# Altium schematic sheet MCU.SchDoc
size A2; DocumentNumber: 2; SheetNumber: 1; SheetTotal: 5
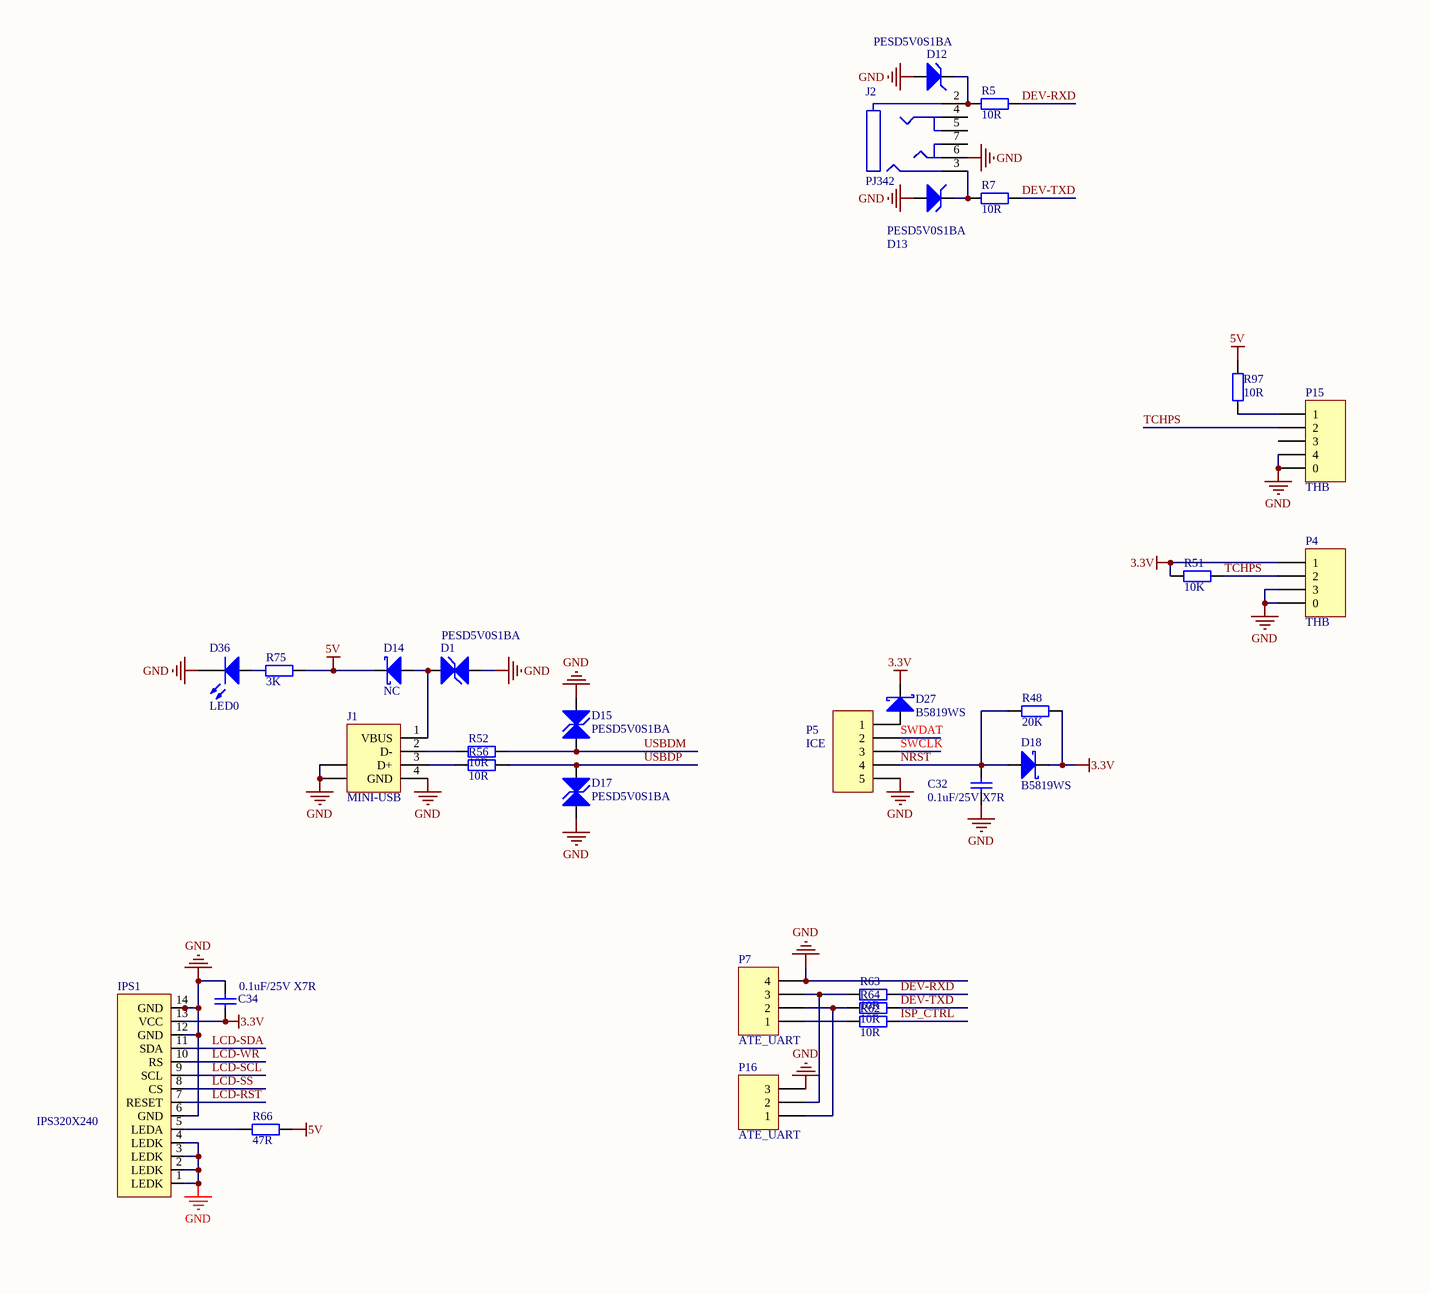
[diagram p0: MCU.SchDoc, left]
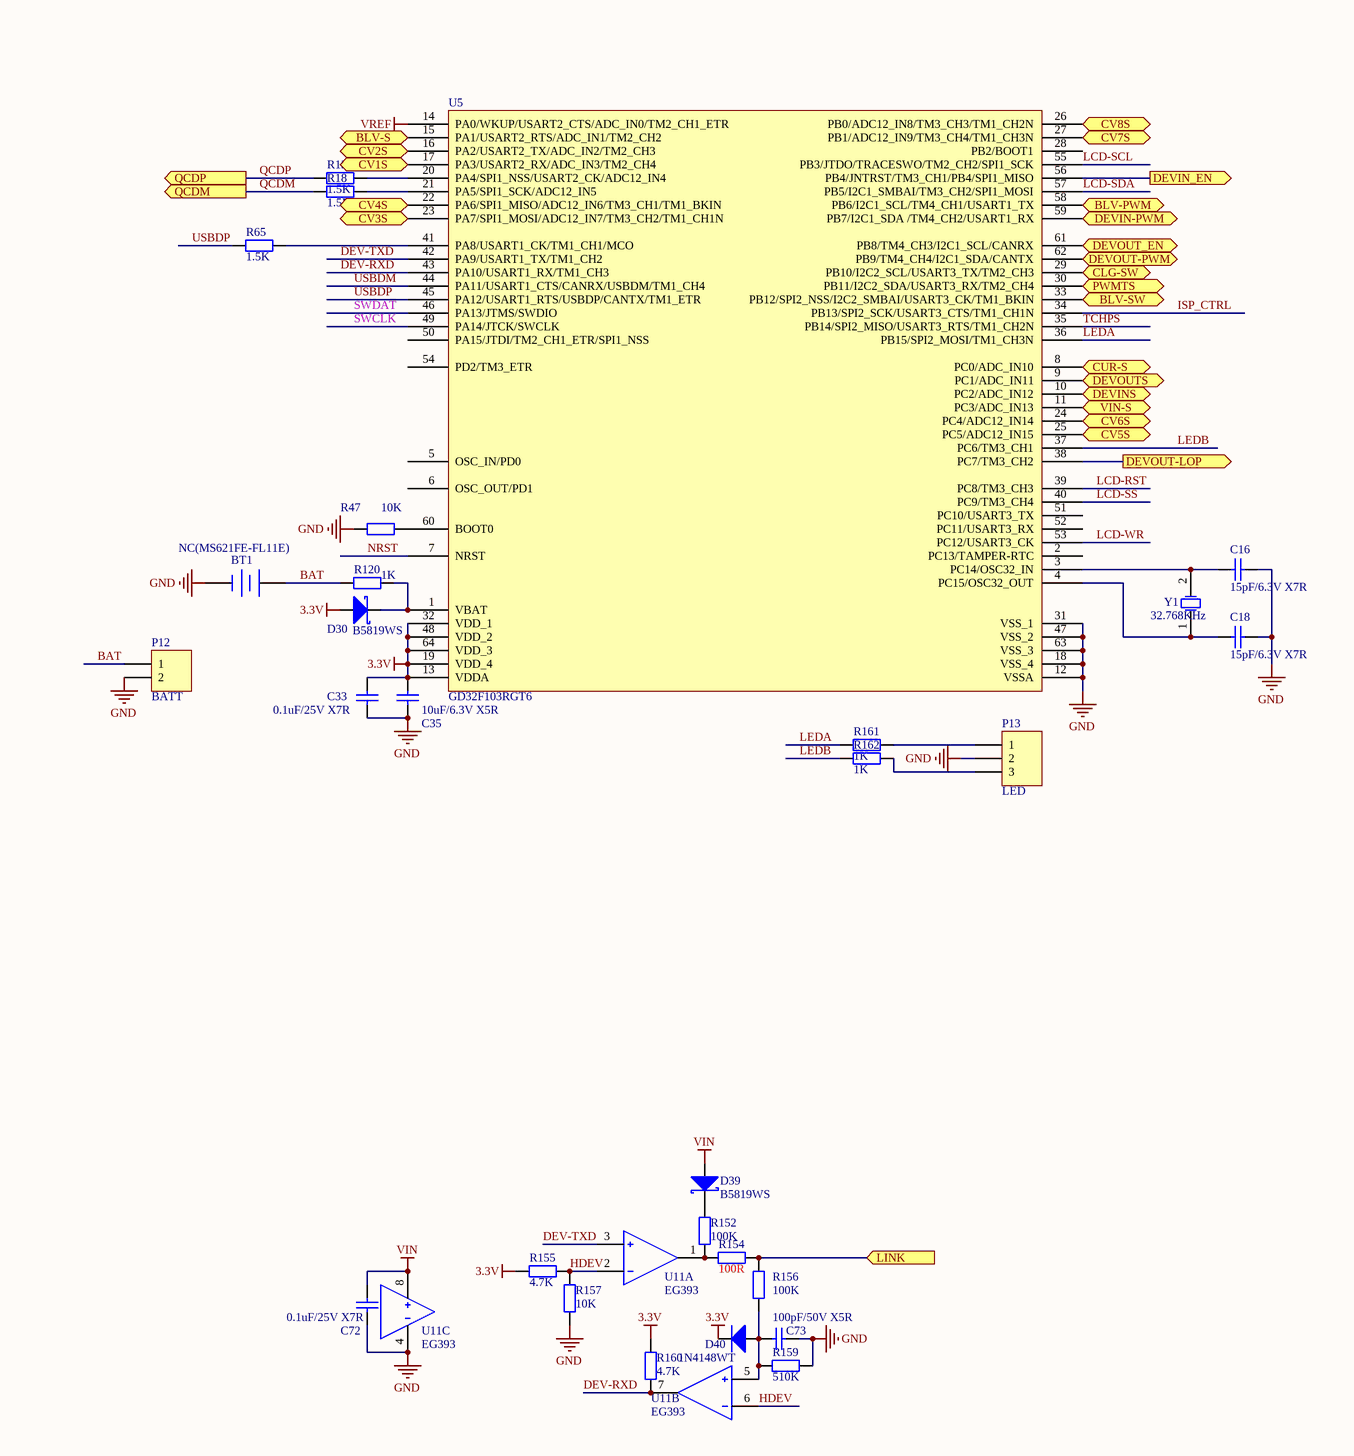
[diagram p1: MCU.SchDoc, right]

## Parts
BT1  NC(MS621FE-FL11E)  [MS621FE FL11E]
C16  15pF/6.3V X7R  [C-0603]
C18  15pF/6.3V X7R  [C-0603]
C32  0.1uF/25V X7R  [C-0603]
C33  0.1uF/25V X7R  [C-0603]
C34  0.1uF/25V X7R  [C-0603]
C35  10uF/6.3V X5R  [C-0603]
C72  0.1uF/25V X7R  [C-0603]
C73  100pF/50V X5R  [C-0603]
D1  PESD5V0S1BA  [SOD-323]
D12  PESD5V0S1BA  [SOD-323]
D13  PESD5V0S1BA  [SOD-323]
D14  NC  [SOD-323]
D15  PESD5V0S1BA  [SOD-323]
D17  PESD5V0S1BA  [SOD-323]
D18  B5819WS  [SOD-323]
D27  B5819WS  [SOD-323]
D30  B5819WS  [SOD-323]
D36  LED0  [LED-SMD-0603]
D39  B5819WS  [SOD-323]
D40  1N4148WT  [SOD-323]
IPS1  IPS320X240  [0.5K-AS-NPWB-14P]
J1  MINI-USB  [USB-MINI-C]
J2  PJ342  [PJ342]
P4  THB  [1.25T-3P-SMT]
P5  ICE  [1.25T-5P]
P7  ATE_UART  [XH 2.54-4P]
P12  BATT  [PH-2A]
P13  LED  [HDR1X3]
P15  THB  [1.25T-4P-SMT]
P16  ATE_UART  [XH 2.54-3P]
R5  10R  [R-0603]
R7  10R  [R-0603]
R13  1.5K  [R-0603]
R18  1.5K  [R-0603]
R47  10K  [R-0603]
R48  20K  [R-0603]
R51  10K  [R-0603]
R52  10R  [R-0603]
R56  10R  [R-0603]
R62  10R  [R-0603]
R63  10R  [R-0603]
R64  10R  [R-0603]
R65  1.5K  [R-0603]
R66  47R  [R-0805]
R75  3K  [R-0603]
R97  10R  [R-0603]
R120  1K  [R-0603]
R152  100K  [R-0603]
R154  100R  [R-0603]
R155  4.7K  [R-0603]
R156  100K  [R-0603]
R157  10K  [R-0603]
R159  510K  [R-0603]
R160  4.7K  [R-0603]
R161  1K  [R-0603]
R162  1K  [R-0603]
U5  GD32F103RGT6  [TSQFP50P1200X1200X160-64N]
U11  EG393  [SOIC8]  (parts A,B,C of 3)
Y1  32.768KHz  [DT-38]

## Ports
BLV-PWM (out), BLV-S (in), BLV-SW (out), CLG-SW (out), CUR-S (in), CV1S (in), CV2S (in), CV3S (in), CV4S (in), CV5S (in), CV6S (in), CV7S (in), CV8S (in), DEVIN-PWM (out), DEVIN_EN (out), DEVINS (in), DEVOUT-LOP (out), DEVOUT-PWM (out), DEVOUT_EN (out), DEVOUTS (in), LINK (in), PWMTS (out), QCDM (out), QCDP (out), VIN-S (in)

## Nets
3.3V: C33.2 C34.2 C35.2 D18.2(K) D27.2(K) D30.1(A) D40.2(K) IPS1.13(VCC) P4.1 R48.1 R51.2 R155.2 R160.2 U5.13(VDDA) U5.19(VDD_4) U5.32(VDD_1) U5.48(VDD_2) U5.64(VDD_3)
5V: D14.2(K) R66.2 R75.1 R97.2
GND: BT1.2(-) C16.1 C18.1 C32.2 C33.1 C34.1 C35.1 C72.2 C73.1 D1.1 D12.1(A) D13.1(A) D15.1 D17.1 D36.2(K) IPS1.0 IPS1.1(LEDK) IPS1.2(LEDK) IPS1.3(LEDK) IPS1.4(LEDK) IPS1.6(GND) IPS1.12(GND) IPS1.14(GND) J1.4(GND) J1.5(SHLD) J1.6(SHLD) J2.6 P4.0 P4.3 P5.5 P7.4 P12.2 P13.2 P15.0 P15.4 P16.3 R47.2 R157.1 R159.1 U5.12(VSSA) U5.18(VSS_4) U5.31(VSS_1) U5.47(VSS_2) U5.63(VSS_3) U11.4
VIN: C72.1 D39.1(A) U11.8
VREF: U5.14(PA0/WKUP/USART2_CTS/ADC_IN0/TM2_CH1_ETR)
BAT: BT1.1(+) P12.1 R120.2
BLV-PWM: U5.58(PB6/I2C1_SCL/TM4_CH1/USART1_TX) ; port BLV-PWM
BLV-S: U5.15(PA1/USART2_RTS/ADC_IN1/TM2_CH2) ; port BLV-S
BLV-SW: U5.33(PB12/SPI2_NSS/I2C2_SMBAI/USART3_CK/TM1_BKIN) ; port BLV-SW
CLG-SW: U5.29(PB10/I2C2_SCL/USART3_TX/TM2_CH3) ; port CLG-SW
CUR-S: U5.8(PC0/ADC_IN10) ; port CUR-S
CV1S: U5.17(PA3/USART2_RX/ADC_IN3/TM2_CH4) ; port CV1S
CV2S: U5.16(PA2/USART2_TX/ADC_IN2/TM2_CH3) ; port CV2S
CV3S: U5.23(PA7/SPI1_MOSI/ADC12_IN7/TM3_CH2/TM1_CH1N) ; port CV3S
CV4S: U5.22(PA6/SPI1_MISO/ADC12_IN6/TM3_CH1/TM1_BKIN) ; port CV4S
CV5S: U5.25(PC5/ADC12_IN15) ; port CV5S
CV6S: U5.24(PC4/ADC12_IN14) ; port CV6S
CV7S: U5.27(PB1/ADC12_IN9/TM3_CH4/TM1_CH3N) ; port CV7S
CV8S: U5.26(PB0/ADC12_IN8/TM3_CH3/TM1_CH2N) ; port CV8S
DEV-RXD: R5.1 R63.1 R160.1 U5.43(PA10/USART1_RX/TM1_CH3) U11.7
DEV-TXD: R7.2 R64.1 U5.42(PA9/USART1_TX/TM1_CH2) U11.3
DEVIN-PWM: U5.59(PB7/I2C1_SDA_/TM4_CH2/USART1_RX) ; port DEVIN-PWM
DEVIN_EN: U5.56(PB4/JNTRST/TM3_CH1/PB4/SPI1_MISO) ; port DEVIN_EN
DEVINS: U5.10(PC2/ADC_IN12) ; port DEVINS
DEVOUT-LOP: U5.38(PC7/TM3_CH2) ; port DEVOUT-LOP
DEVOUT-PWM: U5.62(PB9/TM4_CH4/I2C1_SDA/CANTX) ; port DEVOUT-PWM
DEVOUT_EN: U5.61(PB8/TM4_CH3/I2C1_SCL/CANRX) ; port DEVOUT_EN
DEVOUTS: U5.9(PC1/ADC_IN11) ; port DEVOUTS
HDEV: R155.1 R157.2 U11.2 U11.6
ISP_CTRL: R62.1 U5.34(PB13/SPI2_SCK/USART3_CTS/TM1_CH1N)
LCD-RST: IPS1.7(RESET) U5.39(PC8/TM3_CH3)
LCD-SCL: IPS1.9(SCL) U5.55(PB3/JTDO/TRACESWO/TM2_CH2/SPI1_SCK)
LCD-SDA: IPS1.11(SDA) U5.57(PB5/I2C1_SMBAI/TM3_CH2/SPI1_MOSI)
LCD-SS: IPS1.8(CS) U5.40(PC9/TM3_CH4)
LCD-WR: IPS1.10(RS) U5.53(PC12/USART3_CK)
LEDA: R161.2 U5.36(PB15/SPI2_MOSI/TM1_CH3N)
LEDB: R162.2 U5.37(PC6/TM3_CH1)
LINK: R154.1 R156.1 ; port LINK
NRST: C32.1 D18.1(A) P5.4 R48.2 U5.7(NRST)
PWMTS: U5.30(PB11/I2C2_SDA/USART3_RX/TM2_CH4) ; port PWMTS
QCDM: R18.2 ; port QCDM
QCDP: R13.2 ; port QCDP
SWCLK: P5.3 U5.49(PA14/JTCK/SWCLK)
SWDAT: P5.2 U5.46(PA13/JTMS/SWDIO)
TCHPS: P4.2 P15.2 R51.1 U5.35(PB14/SPI2_MISO/USART3_RTS/TM1_CH2N)
USBDM: D15.2 R52.1 U5.44(PA11/USART1_CTS/CANRX/USBDM/TM1_CH4)
USBDP: D17.2 R56.1 R65.1 U5.45(PA12/USART1_RTS/USBDP/CANTX/TM1_ETR)
VIN-S: U5.11(PC3/ADC_IN13) ; port VIN-S
NetC16_2: C16.2 U5.3(PC14/OSC32_IN) Y1.2(OSC2)
NetC18_2: C18.2 U5.4(PC15/OSC32_OUT) Y1.1(OSC1)
NetC73_2: C73.2 D40.1(A) R156.2 R159.2 U11.5
NetD1_2: D1.2 D14.1(A) J1.1(VBUS)
NetD12_2: D12.2(K) J2.2 R5.2
NetD13_2: D13.2(K) J2.3 R7.1
NetD27_1: D27.1(A) P5.1
NetD30_2: D30.2(K) R120.1 U5.1(VBAT)
NetD36_1: D36.1(A) R75.2
NetD39_2: D39.2(K) R152.1
NetIPS1_5: IPS1.5(LEDA) R66.1
NetJ1_2: J1.2(D-) R52.2
NetJ1_3: J1.3(D+) R56.2
NetP7_1: P7.1 R62.2
NetP7_2: P7.2 P16.1 R64.2
NetP7_3: P7.3 P16.2 R63.2
NetP13_1: P13.1 R161.1
NetP13_3: P13.3 R162.1
NetP15_1: P15.1 R97.1
NetR13_1: R13.1 U5.20(PA4/SPI1_NSS/USART2_CK/ADC12_IN4)
NetR18_1: R18.1 U5.21(PA5/SPI1_SCK/ADC12_IN5)
NetR47_1: R47.1 U5.60(BOOT0)
NetR65_2: R65.2 U5.41(PA8/USART1_CK/TM1_CH1/MCO)
NetR152_2: R152.2 R154.2 U11.1

Not connected (* = marked no-connect by the designer): J2 4 5 7; P15 3; U5 2(PC13/TAMPER-RTC) 5(OSC_IN/PD0) 6(OSC_OUT/PD1) 28(PB2/BOOT1) 50(PA15/JTDI/TM2_CH1_ETR/SPI1_NSS) 51(PC10/USART3_TX) 52(PC11/USART3_RX) 54(PD2/TM3_ETR)

## Library data of the parts
BT1 = Battery: Multicell Battery; Published: 24-Mar-1999; LatestRevisionDate: 17-Jul-2002; LatestRevisionNote: Re-released for DXP Platform.; PackageReference: BAT-2; Publisher: Altium Limited; PackageDescription: Battery; 2 Leads
C16 C18 C32-C35 C72 C73 = Cap: Capacitor; Published: 8-Jun-2000; LatestRevisionDate: 17-Jul-2002; LatestRevisionNote: Re-released for DXP Platform.; PackageReference: RAD-0.3; Publisher: Altium Limited; PackageDescription: Radial Cap, Thru-Hole; 2 Leads; 0.3 in Pin Spacing
  C16 C18: Value: 15pF/6.3V X7R
  C32-C34 C72: Value: 0.1uF/25V X7R
  C35: Value: 10uF/6.3V X5R
  C73: Value: 100pF/50V X5R
D1 D15 D17 = TVS-D
D12 D13 = D Zener: Zener Diode; Published: 8-Jun-2000; LatestRevisionDate: 17-Jul-2002; LatestRevisionNote: Re-released for DXP Platform.; PackageReference: DIODE-0.7; Publisher: Altium Limited; PackageDescription: Diode, Thru-Hole; 2 Leads; 0.7 in Pin Spacing
D14 D27 = D Schottky: Schottky Diode; Manufacturer: Generic Components; Class: Discrete; SubClass: Diode - Schottky; Published: 08/06/2000; Publisher: Altium Hobart Technology Centre
D18 D30 D39 = D Schottky: Schottky Diode; Published: 8-Jun-2000; LatestRevisionDate: 17-Jul-2002; LatestRevisionNote: Re-released for DXP Platform.; PackageReference: SMB; Publisher: Altium Limited; Code_JEDEC: DO-214-AA
D36 = LED0: Typical INFRARED GaAs LED; Published: 8-Jun-2000; LatestRevisionDate: 08-Jul-2005; LatestRevisionNote: Mech Layer 1 removed.; PackageReference: LED-0; Publisher: Altium Limited; PackageDescription: LED; 2 Leads
D40 = Diode: Default Diode; Published: 8-Jun-2000; LatestRevisionDate: 17-Jul-2002; LatestRevisionNote: Re-released for DXP Platform.; PackageVersion: Sep-1996; PackageReference: SMC; Publisher: Altium Limited; PackageDescription: DO-214-AB/SMC; 2 C-Bend Leads; Body 7.9 x 5.9 mm, inc. leads (LxW); Code_JEDEC: DO-214-AB
IPS1 = IPS320X240-14
J1 = 440314-1: USB 1.1, Right Angle, Thru-Hole, Series A, Reverse Type, Receptacle, 4 Position, Black; ContactMaterial: Copper Alloy; ContactPlating: Gold (30); TerminationLength: 2.22mm [0.088in.]; PCB_Layout: Complies with manufacturer's recommendation.; DrillSize: Corresponds to nominal value.; PanelGround: Without; Published: 15-Jul-2004; DatasheetDocument: 08-Sep-2003; PackageDocument: 08-Sep-2003; PackageReference: 440314; Publisher: Altium Limited; HousingMaterial: Glass-Filled Thermoplastic; ComponentLink1Description: Manufacturer Link; ComponentLink1URL: http://www.tycoelectronics.com/; ComponentLink2Description: Packaging Specification; ComponentLink2URL: http://ecommas.tycoelectronics.com/commerce/DocumentDelivery/DDEController?Action=showdoc&DocId=Customer+Drawing%7F440314%7FF%7Ftif%7FEnglish%7FC_440314_F.tif
P4 P7 = Header 4: Header, 4-Pin; LatestRevisionDate: 17-Jul-2002; LatestRevisionNote: Re-released for DXP Platform.; Publisher: Altium Limited
P5 P15 = Header 5: Header, 5-Pin; LatestRevisionDate: 17-Jul-2002; LatestRevisionNote: Re-released for DXP Platform.; Publisher: Altium Limited
P12 = Header 2: Header, 2-Pin; LatestRevisionDate: 17-Jul-2002; LatestRevisionNote: Re-released for DXP Platform.; Publisher: Altium Limited
P13 = Header 3: 共阴双色LED; LatestRevisionDate: 17-Jul-2002; LatestRevisionNote: Re-released for DXP Platform.; Publisher: Altium Limited
P16 = Header 3: Header, 3-Pin; LatestRevisionDate: 17-Jul-2002; LatestRevisionNote: Re-released for DXP Platform.; Publisher: Altium Limited
R5 R7 R13 R18 R47 R48 R51 R52 R56 R62-R66 R75 R97 R120 R152 R154-R157 R159-R162 = Res2: Resistor; Published: 8-Jun-2000; LatestRevisionDate: 17-Jul-2002; LatestRevisionNote: Re-released for DXP Platform.; PackageReference: AXIAL-0.4; Publisher: Altium Limited
  R5 R7 R97: Value: 10R
  R13 R18 R65: PackageDescription: Axial Device, Thru-Hole; 2 Leads; 0.4 in Pin Spacing; Value: 1.5K
  R47 R51 R157: Value: 10K
  R48: Value: 20K
  R52 R56 R62-R64: PackageDescription: Axial Device, Thru-Hole; 2 Leads; 0.4 in Pin Spacing; Value: 10R
  R66: Value: 47R
  R75: PackageDescription: Axial Device, Thru-Hole; 2 Leads; 0.4 in Pin Spacing; Value: 3K
  R120: Value: 1K
  R152 R156: Value: 100K
  R154: Value: 100R
  R155 R160: Value: 4.7K
  R159: Value: 510K
  R161 R162: PackageDescription: Axial Device, Thru-Hole; 2 Leads; 0.4 in Pin Spacing; Value: 1K
U5 = GD32F103RBT6: STM32 ARM-based 32-bit MCU with 128 Kbytes Flash, 64-pin LQFP, Industrial Temperature; Published: *; DatasheetVersion: *; PackageVersion: *; PackageReference: *; Publisher: *; PackageDescription: *; ComponentLink1Description: *; ComponentLink1URL: *; ComponentLink2Description: *; ComponentLink2URL: *
U11 = Dual_OPAMP
Y1 = XTAL: Crystal Oscillator; Published: 8-Jun-2000; LatestRevisionDate: 17-Jul-2002; LatestRevisionNote: Re-released for DXP Platform.; PackageReference: R38; Publisher: Altium Limited; PackageDescription: Crystal, Thru-Hole; 2 Leads; Body 3.1 x 8.2 mm (Dia.xH)